# Altium schematic sheet Cell_Temp_Comparator.SchDoc
size A4; Organization: TESLA Motors, INC; Address1: 3500 Deer Creek Road; Address2: Palo Alto, CA; Address4: U.S.A.; SheetNumber: 3; SheetTotal: 8
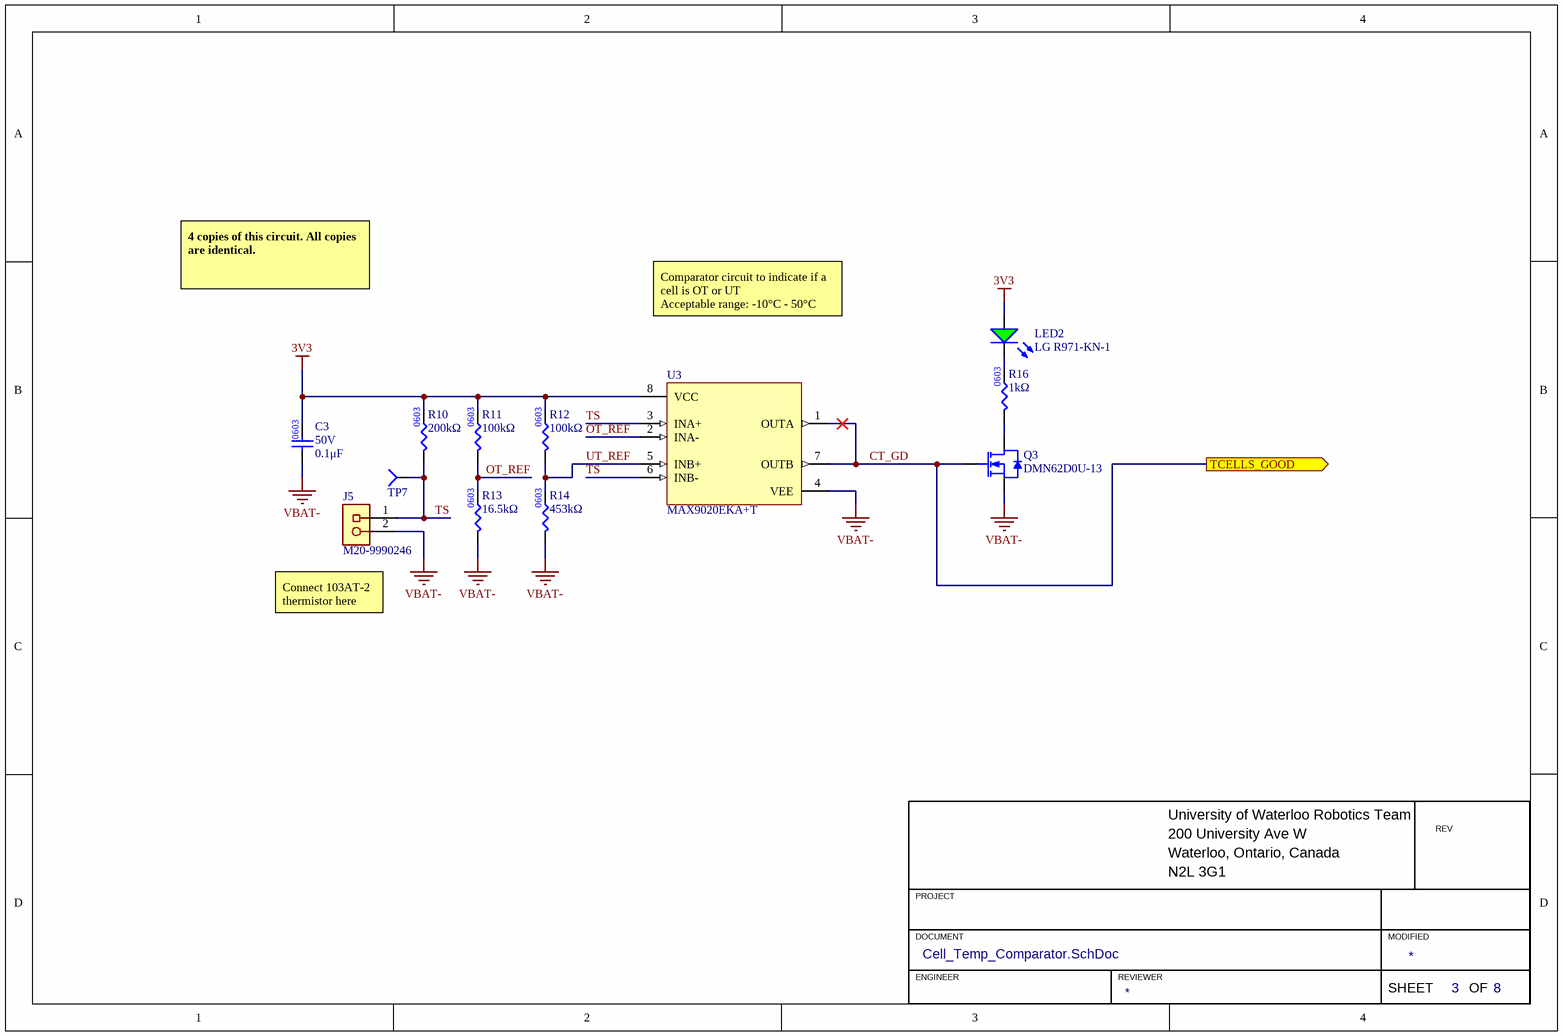
[diagram p0: Cell_Temp_Comparator.SchDoc]

## Parts
C3  value 0.1μF  Voltage Rating: 50V  [CAP0603]  (hidden comment: CAP_0.1uF_50V_0603)
J5  Manufacturer Part Number 1: M20-9990246  [HDR1X2]  (hidden comment: HEADER 2x1)
LED2  Manufacturer Part Number 1: LG R971-KN-1  [LED_0805_GREEN]  (hidden comment: LED_GREEN)
Q3  Manufacturer Part Number 1: DMN62D0U-13  [NMOS_SSOT-3]  (hidden comment: NMOS_60V_380mA)
R10  value 200kΩ  [RES0603]  (hidden comment: RES_200kΩ_0603_1%)
R11  value 100kΩ  [RES0603]  (hidden comment: RES_100kΩ_0603_1%)
R12  value 100kΩ  [RES0603]  (hidden comment: RES_100kΩ_0603_1%)
R13  value 16.5kΩ  [RES0603]  (hidden comment: RES_16.5kΩ_0603_1%)
R14  value 453kΩ  [RES0603]  (hidden comment: RES_453kΩ_0603_1%)
R16  value 1kΩ  [RES0603]  (hidden comment: RES_1kΩ_0603_1%)
TP7  TESTPOINT_1MM_CIRCLE  [TESTPOINT_CIRCLE_1MM]  (value not drawn)  (no BOM)
U3  Manufacturer Part Number 1: MAX9020EKA+T  [SOT23-8 MAXIM]  (hidden comment: IC_COMPARATOR_MAX9020)

## Ports
TCELLS_GOOD (out)

## Nets
3V3: C3.2 LED2.1(A) R10.2 R11.2 R12.2 U3.8(VCC)
VBAT-: C3.1 J5.2 Q3.2(SOURCE) R13.1 R14.1 U3.4(VEE)
CT_GD: Q3.1(GATE) U3.1(OUTA) U3.7(OUTB) ; port TCELLS_GOOD
OT_REF: R11.1 R13.2 U3.2(INA-)
TS: J5.1(VCC) R10.1 TP7.1(=value) U3.3(INA+) U3.6(INB-)
UT_REF: R12.1 R14.2 U3.5(INB+)
NetLED2_2: LED2.2(K) R16.2
NetQ3_3: Q3.3(DRAIN) R16.1

## Notes on the sheet
- 4 copies of this circuit. All copies are identical.
- Comparator circuit to indicate if a cell is OT or UT
  Acceptable range: -10°C - 50°C
- (near J5) Connect 103AT-2 thermistor here
- University of Waterloo Robotics Team
- 200 University Ave W
- REV
- PROJECT
- Waterloo, Ontario, Canada
- N2L 3G1
- DOCUMENT
- ENGINEER
- REVIEWER
- MODIFIED
- SHEET
- OF
- (in symbol RES_16.5kΩ_0603_1%) 0603
- (in symbol RES_100kΩ_0603_1%) 0603

## Library data of the parts
C3 = CAP_0.1uF_50V_0603: CAP CER 0.1UF 50V X7R 0603; Manufacturer Part Number 1: CC0603KRX7R9BB104; Manufacturer 1: Yageo; Package/Footprint: 0603; Supplier Part Number 1: 311-1344-1-ND; Supplier 1: Digi-Key; Mounting Type: SMD; Dielectric: X7R
J5 = HEADER 2x1: Manufacturer 1: Harwin Inc.; Package/Footprint: TH; Mounting Type: TH; Supplier 1: Digi-Key; Supplier Part Number 1: 952-2262-ND
LED2 = LED_GREEN: LED GREEN DIFFUSED 0805 SMD; Manufacturer 1: OSRAM; Forward Voltage Drop: 2.2V; Package/Footprint: 0805; Supplier Part Number 1: 475-1410-1-ND; Supplier 1: Digi-Key; Mounting Type: SMD
Q3 = NMOS_60V_380mA: MOSFET N-CH 60V 380MA SOT23; Manufacturer 1: Diodes Incorporated; Vgs (Max): ±12V; Supplier 1: Digi-Key; Mounting Type: SMD; Package: SOT-23-3; Supplier Part Number 1: DMN62D0U-13DICT-ND; Id: 380mA; Vdss: 60V
R10 = RES_200kΩ_0603_1%: RES 200K OHM 1% 1/10W 0603; Manufacturer 1: YAGEO; Manufacturer Part Number 1: RC0603FR-13200KL; Package/Footprint: 0603; Supplier Part Number 1: 13-RC0603FR-13200KLCT-ND; Supplier 1: Digi-Key; Mounting Type: SMD
R11 R12 = RES_100kΩ_0603_1%: RES 100K OHM 1% 1/10W 0603; Manufacturer 1: Yageo; Manufacturer Part Number 1: RC0603FR-07100KL; Supplier Part Number 1: 311-100KHRCT-ND; Supplier 1: Digi-Key
R13 = RES_16.5kΩ_0603_1%: RES 16.5K OHM 1% 1/10W 0603; Manufacturer 1: Yageo; Manufacturer Part Number 1: RC0603FR-0716K5L; Supplier 1: Digi-Key; Supplier Part Number 1: 311-16.5KHRCT-ND
R14 = RES_453kΩ_0603_1%: RES 453K OHM 1% 1/10W 0603; Manufacturer 1: Panasonic Electronic Components; Manufacturer Part Number 1: ERJ-3EKF4533V; Supplier Part Number 1: P453KHCT-ND; Supplier 1: Digi-Key; Mounting Type: SMD; Package: 0603
R16 = RES_1kΩ_0603_1%: RES 1K OHM 1% 1/8W 0603; Manufacturer 1: Stackpole Electronics Inc; Manufacturer Part Number 1: RNCP0603FTD1K00; Supplier Part Number 1: RNCP0603FTD1K00CT-ND; Supplier 1: Digi-Key; Mounting Type: SMD; Package: 0603
TP7 = TESTPOINT_1MM_CIRCLE: TESTPOINT 1MM CIRCLE
U3 = IC_COMPARATOR_MAX9020: IC COMPARATOR DUAL SOT23-8; Manufacturer 1: Analog Devices Inc./Maxim Integrated; Package/Footprint: SOT-23-8; Mounting Type: SMD; Supplier 1: Digi-Key; Supplier Part Number 1: MAX9020EKA+TCT-ND